# EAGLE design Shutter Driver with DMUX4 (EAGLE 9.0.1)
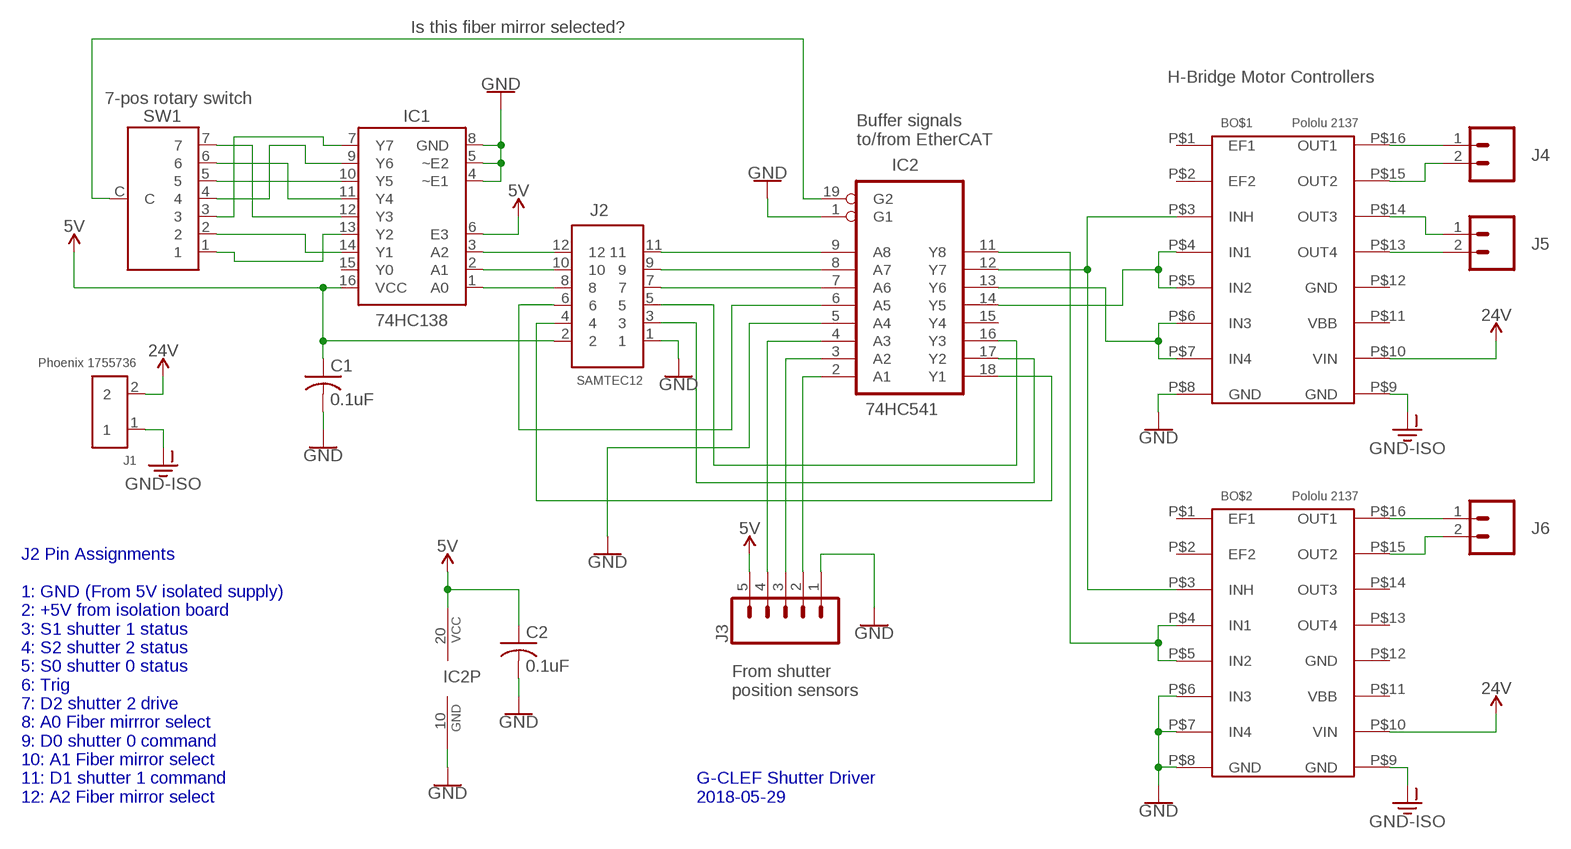
[diagram p0: schematic, sheet 1]

## Parts
BO$1  Pololu 2137  POLOLU2137  [POLOLU2137]
BO$2  Pololu 2137  POLOLU2137  [POLOLU2137]
C1  0.1uF  C-USC0805  [C0805]
C2  0.1uF  C-USC0805  [C0805]
IC1  74HC138  74HC238  [SO16]
IC2  74HC541  74LS541DW  [SO20W]
J1  Phoenix 1755736  MSTBVA  [MSTBVA]
J2  SAMTEC12  [SAMTEC12]
J3  CONN_05  [1X05]
J4  CONN_02POLAR_LOCK  [MOLEX-1X2_LOCK]
J5  CONN_02POLAR_LOCK  [MOLEX-1X2_LOCK]
J6  CONN_02POLAR_LOCK  [MOLEX-1X2_LOCK]
SW1  7-pos rotary switch  RMROTARY-SW-7POS  [RMROTARY-SW-7POS]

## Nets
5V: C1.1 C2.1 IC1.6(E3) IC1.16(VCC) IC2.20(VCC) J2.2 J3.5
24V [power]: BO$1.P$10(VIN) BO$2.P$10(VIN) J1.2
GND: BO$1.P$8(GND) BO$2.P$6(IN3) BO$2.P$7(IN4) BO$2.P$8(GND) C1.2 C2.2 IC1.4(~E1) IC1.5(~E2) IC1.8(GND) IC2.1(G1) IC2.5(A4) IC2.10(GND) J2.1 J3.1
GND-ISO [power]: BO$1.P$9(GND) BO$2.P$9(GND) J1.1
N$1 [power]: BO$1.P$13(OUT4) J5.2
N$2 [power]: BO$1.P$14(OUT3) J5.1
N$3: IC1.7(Y7) SW1.3
N$4 [power]: BO$1.P$15(OUT2) J4.2
N$5 [power]: BO$1.P$16(OUT1) J4.1
N$6: IC1.9(Y6) SW1.4
N$7: IC1.10(Y5) SW1.5
N$8: IC1.11(Y4) SW1.6
N$9: IC1.12(Y3) SW1.7
N$10: IC1.13(Y2) SW1.1
N$11 [power]: BO$2.P$15(OUT2) J6.2
N$12 [power]: BO$2.P$16(OUT1) J6.1
N$13: IC1.14(Y1) SW1.2
N$14: IC1.3(A2) J2.12
N$15: IC1.2(A1) J2.10
N$16: IC1.1(A0) J2.8
N$17: IC2.8(A7) J2.9
N$18: IC2.7(A6) J2.7
N$19: IC2.2(A1) J3.2
N$20: IC2.6(A5) J2.6
N$21: IC2.3(A2) J3.3
N$22: IC2.4(A3) J3.4
N$23: IC2.16(Y3) J2.5
N$24: IC2.17(Y2) J2.3
N$25: IC2.18(Y1) J2.4
N$26: IC2.9(A8) J2.11
N$27: BO$1.P$6(IN3) BO$1.P$7(IN4) IC2.13(Y6)
N$29: BO$2.P$4(IN1) BO$2.P$5(IN2) IC2.11(Y8)
N$30: IC2.19(G2) SW1.C
N$32: BO$1.P$3(INH) BO$2.P$3(INH) IC2.12(Y7)
N$34: BO$1.P$4(IN1) BO$1.P$5(IN2) IC2.14(Y5)
Unconnected: BO$1.P$1(EF1) BO$1.P$2(EF2) BO$1.P$11(VBB) BO$2.P$1(EF1) BO$2.P$2(EF2) BO$2.P$11(VBB) BO$2.P$13(OUT4) BO$2.P$14(OUT3) IC1.15(Y0) IC2.15(Y4)

## Notes on the sheet
- Is this fiber mirror selected?
- H-Bridge Motor Controllers
- Buffer signals
  to/from EtherCAT
- From shutter
  position sensors
- J2 Pin Assignments
  
  1: GND (From 5V isolated supply)
  2: +5V from isolation board
  3: S1 shutter 1 status
  4: S2 shutter 2 status
  5: S0 shutter 0 status
  6: Trig
  7: D2 shutter 2 drive
  8: A0 Fiber mirrror select
  9: D0 shutter 0 command
  10: A1 Fiber mirror select
  11: D1 shutter 1 command
  12: A2 Fiber mirror select
- G-CLEF Shutter Driver
  2018-05-29

## Power pins joined to a net without a drawn wire
GND: BO$1.P$12(GND) BO$2.P$12(GND)

## Library data of the parts
BO$1 BO$2 = AU:POLOLU2137: Pololu item #2137 - Dual H-Bridge motor driver Details: Allegro A4990 controller DC motors 6 V to 32 V, 0.7 A each Peak current 0.9 A Inputs 3V and 5V compatible $5.95 each in November 2014 from pololu.com
C1 C2 = rcl:C-US: CAPACITOR, American symbol; SPICEPREFIX: C
IC1 = AU:74HC238
IC2 = 74xx-us:74*541: Octal BUFFER and LINE DRIVER, 3-state
J1 = AU:MSTBVA: Phoenix Contact MSTBVA Vertical Terminal Block Phoenix order number 1755736 Digikey: 277-1150-ND Mating part is Phoneix Contact Combicon Spring Cage plug TFCK 5.08 mm pitch Digikey: 277-6941-ND
J2 = AU:SAMTEC12
J3 = SparkFun-Connectors:CONN_05: Multi connection point. Often used as Generic Header-pin footprint for 0.1 inch spaced/style header connections On any of the 0.1 inch spaced packages, you can populate with these: Break Away Headers - Straight <https://www.sparkfun.com/products/116> (PRT-00116) Break Away Male Headers - Right Angle <https://www.sparkfun.com/products/553> (PRT-00553) Female Headers <https://www.sparkfun.com/products/115> (PRT-00115) Break Away Headers - Machine Pin <https://www.sparkfun.com/products/117> (PRT-00117) Break Away Female Headers - Swiss Machine Pin <https://www.sparkfun.com/products/743> (PRT-00743) For SCREWTERMINALS and SPRING TERMINALS visit here: Screw Terimnals on SparkFun.com <https://www.sparkfun.com/search/results?term=Screw+Terminals> (5mm/3.5mm/2.54mm spacing) This device is also useful as a general connection point to wire up your design to another part of your project. Our various solder wires solder well into these plated through hole pads. Hook-Up Wire - Assortment (Stranded, 22 AWG) <https://www.sparkfun.com/products/11375> (PRT-11375) Hook-Up Wire - Assortment (Solid Core, 22 AWG) <https://www.sparkfun.com/products/11367> (PRT-11367) View the entire wire category on our website here <https://www.sparkfun.com/categories/141> Special notes: Molex polarized connector foot print use with SKU : PRT-08231 with associated crimp pins and housings. 1MM SMD Version SKU: PRT-10208
J4-J6 = SparkFun-Connectors:CONN_02: Multi connection point. Often used as Generic Header-pin footprint for 0.1 inch spaced/style header connections On any of the 0.1 inch spaced packages, you can populate with these: Break Away Headers - Straight <https://www.sparkfun.com/products/116> (PRT-00116) Break Away Male Headers - Right Angle <https://www.sparkfun.com/products/553> (PRT-00553) Female Headers <https://www.sparkfun.com/products/115> (PRT-00115) Break Away Headers - Machine Pin <https://www.sparkfun.com/products/117> (PRT-00117) Break Away Female Headers - Swiss Machine Pin <https://www.sparkfun.com/products/743> (PRT-00743) For SCREWTERMINALS and SPRING TERMINALS visit here: Screw Terimnals on SparkFun.com <https://www.sparkfun.com/search/results?term=Screw+Terminals> (5mm/3.5mm/2.54mm spacing) This device is also useful as a general connection point to wire up your design to another part of your project. Our various solder wires solder well into these plated through hole pads. Hook-Up Wire - Assortment (Stranded, 22 AWG) <https://www.sparkfun.com/products/11375> (PRT-11375) Hook-Up Wire - Assortment (Solid Core, 22 AWG) <https://www.sparkfun.com/products/11367> (PRT-11367) View the entire wire category on our website here <https://www.sparkfun.com/categories/141> Special notes: Molex polarized connector foot print use with: PRT-08233 with associated crimp pins and housings. 2.54_SCREWTERM for use with PRT-10571. 3.5mm Screw Terminal footprints for PRT-08084 5mm Screw Terminal footprints for use with PRT-08432; SF_ID: PRT-09918
SW1 = AU:RMROTARY-SW-7POS

## Net classes
1 power: width 0.305 mm, drill 0.635 mm, clearance 0.381 mm

## Board
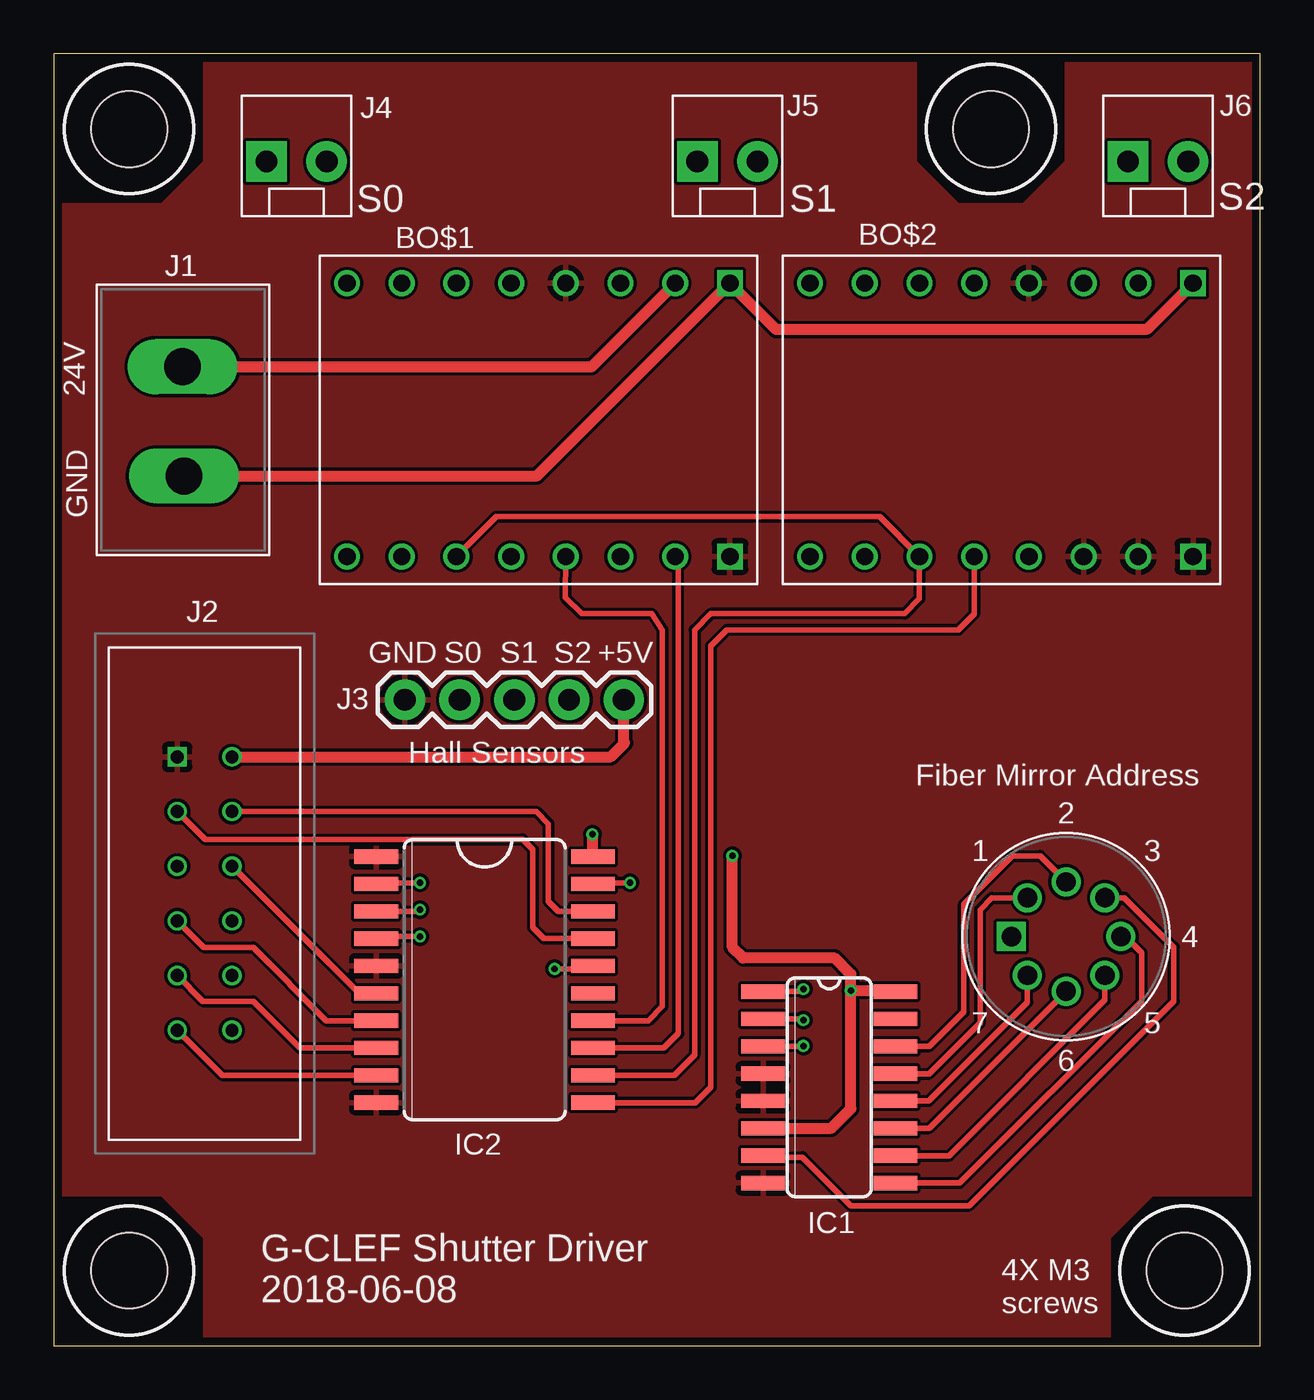
[diagram p1: board, top side]
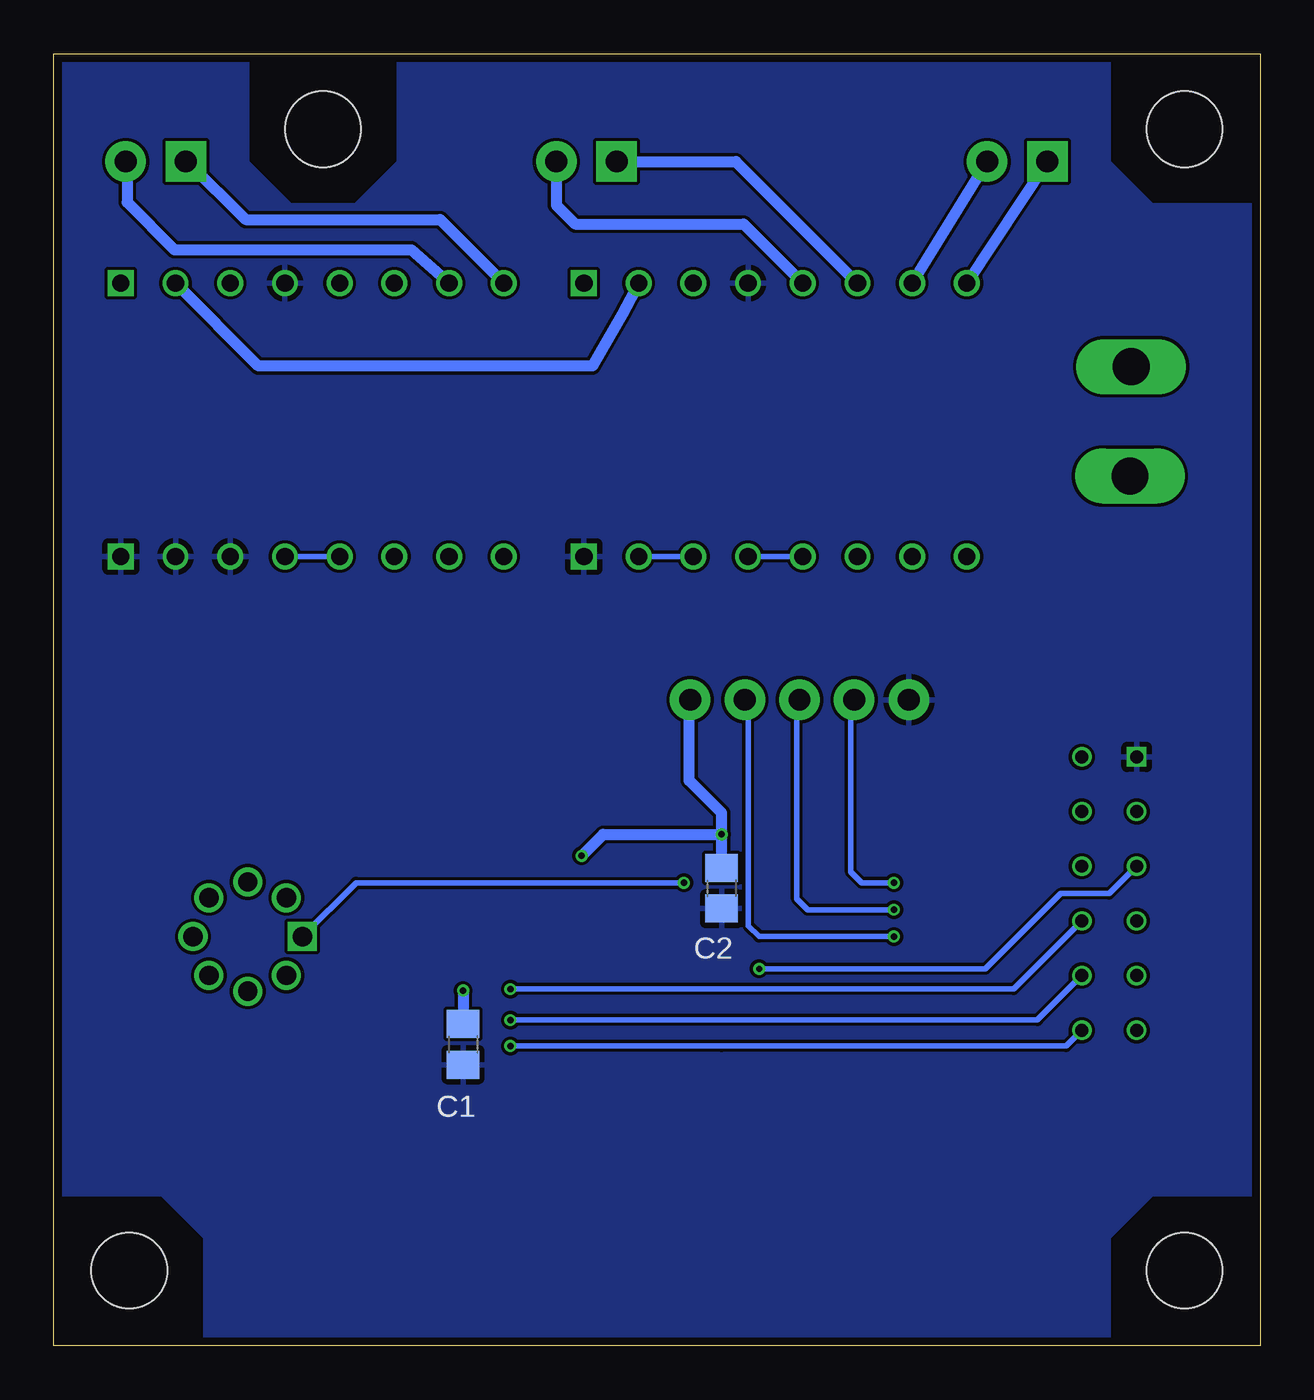
[diagram p2: board, bottom side, seen from below]

Size 56 x 60 mm. Coordinates in mm from the lower left corner, seen from the top.
Outline: 0,0 56,0 56,60 0,60 0,0
Copper layers (1*16): Top 0.035559375mm / dielectric 1.6mm / Bottom 0.035559375mm
Design rules "oshpark-2layer": minimum track width 6mil, minimum drill 10mil, track to track 6mil, track to pad 6mil, pad to pad 6mil, via to via 6mil, smd to smd 6mil, copper to edge 15mil, drill to drill 6mil, minimum pad ring 5mil, minimum via ring 5mil, stop-mask expansion 2.5mil, vias tented up to drill 0mil, thermal gap 10mil
Holes 3.5 mm at 3.5,3.5 52.5,3.5 3.5,56.5 43.5,56.5

### Footprints (pad centres in the part's own frame; a part is rotated, then mirrored left to right if it is on the bottom)
POLOLU2137 = drill 0.8: P$1 -6.35,8.89; P$2 -6.35,6.35; P$3 -6.35,3.81; P$4 -6.35,1.27; P$5 -6.35,-1.27; P$6 -6.35,-3.81; P$7 -6.35,-6.35; P$10 6.35,-6.35; P$11 6.35,-3.81; P$12 6.35,-1.27; P$13 6.35,1.27; P$14 6.35,3.81; P$15 6.35,6.35; P$16 6.35,8.89 | drill 0.8 square: P$8 -6.35,-8.89; P$9 6.35,-8.89
C0805 = smd 1.3 x 1.5: 1 -0.95,0; 2 0.95,0
SO16 = smd 0.66 x 2.032: 1 -4.445,-3.073; 2 -3.175,-3.073; 3 -1.905,-3.073; 4 -0.635,-3.073; 5 0.635,-3.073; 6 1.905,-3.073; 7 3.175,-3.073; 8 4.445,-3.073; 9 4.445,3.073; 10 3.175,3.073; 11 1.905,3.073; 12 0.635,3.073; 13 -0.635,3.073; 14 -1.905,3.073; 15 -3.175,3.073; 16 -4.445,3.073
SO20W = smd 0.66 x 2.032: 1 -5.715,-5.029; 2 -4.445,-5.029; 3 -3.175,-5.029; 4 -1.905,-5.029; 5 -0.635,-5.029; 6 0.635,-5.029; 7 1.905,-5.029; 8 3.175,-5.029; 9 4.445,-5.029; 10 5.715,-5.029; 11 5.715,5.029; 12 4.445,5.029; 13 3.175,5.029; 14 1.905,5.029; 15 0.635,5.029; 16 -0.635,5.029; 17 -1.905,5.029; 18 -3.175,5.029; 19 -4.445,5.029; 20 -5.715,5.029
MSTBVA = drill 1.7 long: 1 -2.61,-0.04; 2 2.47,0.02
SAMTEC12 = drill 0.6 square: 1 -1.27,6.35 | drill 0.6: 2 1.27,6.35; 3 -1.27,3.81; 4 1.27,3.81; 5 -1.27,1.27; 6 1.27,1.27; 7 -1.27,-1.27; 8 1.27,-1.27; 9 -1.27,-3.81; 10 1.27,-3.81; 11 -1.27,-6.35; 12 1.27,-6.35
1X05 = drill 1.016 pad 1.88: 1 0,0; 2 2.54,0; 3 5.08,0; 4 7.62,0; 5 10.16,0
MOLEX-1X2_LOCK = drill 1.016 pad 1.88 square: 1 -0.127,0 | drill 1.016 pad 1.88: 2 2.667,0
RMROTARY-SW-7POS = drill 0.9: 1 1.8,1.8; 2 2.54,0; 3 1.8,-1.8; 4 0,-2.54; 5 -1.8,-1.8; 6 -2.54,0; 7 -1.8,1.8 | drill 0.9 square: C 0,2.54

### Placement (x,y rotation side)
BO$1  22.5,43 90 top
BO$2  44,43 90 top
C1  37,14 270 bottom
C2  25,21.25 270 bottom
IC1  36,12 270 top
IC2  20,17 270 top
J1  6,43 90 top
J2  7,21 0 top
J3  16.3,30 0 top
J4  10,55 0 top
J5  30,55 0 top
J6  50,55 0 top
SW1  47,19 90 top

### Tracks (layer width: path | path; a pad name or v marks a point on that pad's centre or on a via)
5V  (via drill 0.3)
  Top 0.508: v25,23.75 25,22.74 IC2.20 | v37,16.5 39.02,16.5 IC1.16 | v37,16.5 37,11 36.09,10.1 IC1.6 | v37,16.5 37,17.25 36.25,18 32,18 31.5,18.5 v31.5,22.75 | J2.2 25.85,27.35 26.5,28 26.46,28.04 J3.5
  Bottom 0.508: v25,23.75 25,24.75 26.5,26.25 26.5,30 J3.5 | C2.1 v25,23.75 | v31.5,22.75 30.5,23.75 v25,23.75 | v37,16.5 C1.1
24V
  Top 0.508: J1.2 24.97,45.47 BO$1.P$10
  Bottom 0.508: BO$1.P$10 29.6,47.9 31,45.5 46.5,45.5 BO$2.P$10
GND
  pour Top: 0,53 5,53 7,55 7,60 40,60 40,55 42,53 45,53 47,55 47,60 56,60 56,7 51,7 49,5 49,0 7,0 7,5 5,7 0,7
  pour Bottom: 7,60 40,60 40,55 42,53 45,53 47,55 47,60 56,60 56,7 51,7 49,5 49,0 7,0 7,5 6,6 5,7 0,7 0,53 5,53 7,55
GND-ISO
  Top 0.508: J1.1 22.43,40.39 BO$1.P$9 33.54,47.2 50.74,47.2 BO$2.P$9
N$1
  Bottom 0.508: J5.2 32.67,52.97 31.8,52.1 23.98,52.1 BO$1.P$13
N$2
  Bottom 0.508: J5.1 24.34,55 BO$1.P$14
N$3
  Top 0.254: IC1.7 33,8.75 34.75,8.75 37,6.5 42.5,6.5 52,16 52,18.5 49.7,20.8 SW1.3
N$4
  Bottom 0.508: J4.2 BO$1.P$15
N$5
  Bottom 0.508: J4.1 BO$1.P$16
N$6
  Top 0.254: IC1.9 42.05,7.55 50.5,16 50.5,18.25 49.75,19 SW1.4
N$7
  Top 0.254: IC1.10 41.58,8.82 48.8,16.05 SW1.5
N$8
  Top 0.254: IC1.11 40.63,10.1 SW1.6
N$9
  Top 0.254: IC1.12 40.62,11.37 45.2,15.95 SW1.7
N$10
  Top 0.254: IC1.13 40.63,12.63 43,15 43,20.25 43.55,20.8 SW1.1
N$11
  Bottom 0.508: J6.2 52.6,54.93 52.6,53.1 50.4,50.9 39.4,50.9 BO$2.P$15
N$12
  Bottom 0.508: J6.1 49.8,55 47.1,52.3 38.06,52.3 BO$2.P$16
N$13
  Top 0.254: IC1.14 40.66,13.9 42.25,15.5 42.25,20.5 44.5,22.75 45.79,22.75 SW1.2
N$14  (via drill 0.3)
  Top 0.254: v34.8,13.92 34.78,13.9 IC1.3
  Bottom 0.254: J2.12 9,13.92 25,13.92 v34.8,13.92
N$15  (via drill 0.3)
  Top 0.254: v34.8,15.12 34.74,15.18 IC1.2
  Bottom 0.254: J2.10 10.34,15.12 v34.8,15.12
N$16  (via drill 0.3)
  Top 0.254: v34.8,16.56 34.69,16.45 IC1.1
  Bottom 0.254: J2.8 11.44,16.56 v34.8,16.56
N$17
  Top 0.254: J2.9 6.92,16 9.25,16 11.43,13.82 IC2.8
N$18
  Top 0.254: J2.7 6.96,18.5 9.25,18.5 12.65,15.1 IC2.7
N$19  (via drill 0.3)
  Top 0.254: IC2.2 15.03,21.5 v17,21.5
  Bottom 0.254: J3.2 19,29.84 19,22 18.5,21.5 v17,21.5
N$20
  Top 0.254: J2.6 14.18,16.36 IC2.6
N$21  (via drill 0.3)
  Top 0.254: IC2.3 16.93,20.18 v17,20.25
  Bottom 0.254: v17,20.25 21,20.25 21.5,20.75 21.5,29.88 J3.3
N$22  (via drill 0.3)
  Top 0.254: IC2.4 15.07,19 v17,19
  Bottom 0.254: J3.4 23.75,29.83 23.75,19.5 23.25,19 v17,19
N$23  (via drill 0.3)
  Top 0.254: v23.25,17.5 24.89,17.5 IC2.16
  Bottom 0.254: J2.5 7,21 9.25,21 12.75,17.5 v23.25,17.5
N$24
  Top 0.254: J2.3 7.02,23.52 21.76,23.52 22.24,23.04 22.24,19.42 22.75,18.91 IC2.17
N$25
  Top 0.254: J2.4 22.39,24.81 22.96,24.24 22.96,20.64 23.43,20.18 IC2.18
N$26
  Top 0.254: J2.11 7.83,12.55 IC2.9
N$27
  Top 0.254: IC2.13 28.32,13.82 29,14.5 29,36.5 BO$1.P$7
  Bottom 0.254: BO$1.P$6 BO$1.P$7
N$29
  Top 0.254: BO$2.P$4 42.73,33.98 42,33.25 31.25,33.25 30.5,32.5 30.5,12 29.79,11.29 IC2.11
  Bottom 0.254: BO$2.P$5 BO$2.P$4
N$30  (via drill 0.3)
  Top 0.254: v26.75,21.5 25.08,21.5 IC2.19
  Bottom 0.254: SW1.C 41.96,21.5 v26.75,21.5
N$32
  Top 0.254: BO$1.P$3 20.54,38.5 38.34,38.5 BO$2.P$3 40.19,34.69 39.5,34 30.5,34 29.75,33.25 29.75,13.5 28.8,12.55 IC2.12
N$34
  Top 0.254: BO$1.P$5 23.75,34.75 24.5,34 27.75,34 28.25,33.25 28.25,15.75 27.59,15.1 IC2.14
  Bottom 0.254: BO$1.P$4 BO$1.P$5

### Text on the board
tPlace: S0 | S1 | S2 | 24V | GND | GND | S0 | S1 | S2 | +5V | Hall Sensors | Fiber Mirror Address | 2 | 1 | 3 | 4 | 7 | 5 | 6 | G-CLEF Shutter Driver / 2018-06-08 | 4X M3 / screws